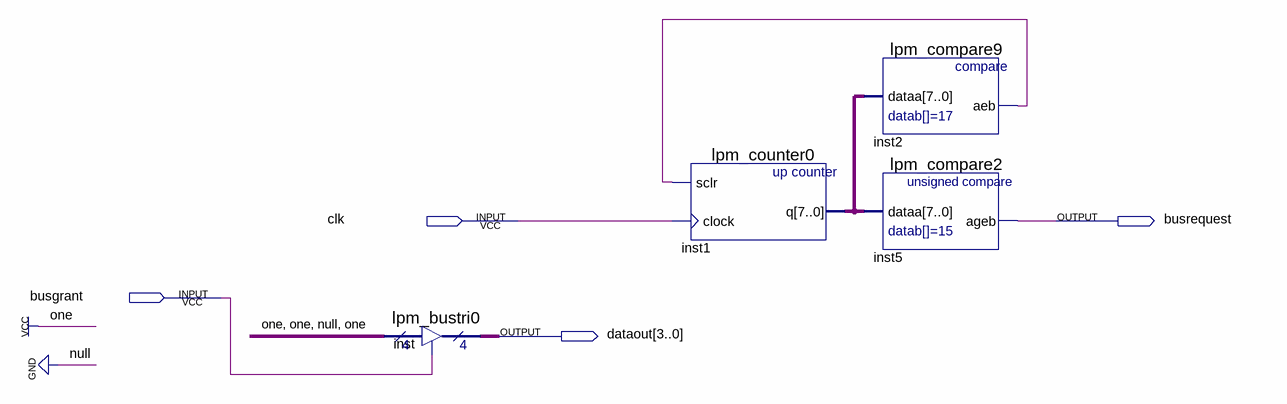
[diagram p0: schematic sheet]
// Quartus schematic lead_3.bdf as structural Verilog: 4 symbols, 4 pins
module lead_3 (
  input  clk,
  input  busgrant,
  output busrequest,
  output [3:0] dataout
);

  wire inst2_aeb;
  wire [7:0] inst1_q;

  lpm_bustri0 inst (.enabledt(busgrant), .data(4'b1101), .tridata(dataout));
  lpm_counter0 inst1 (.sclr(inst2_aeb), .clock(clk), .q(inst1_q));
  lpm_compare9 inst2 (.dataa(inst1_q), .aeb(inst2_aeb));
  lpm_compare2 inst5 (.dataa(inst1_q), .ageb(busrequest));
endmodule
